# EAGLE schematic Rollo_APP_TS_V0.3 (EAGLE 6.4)
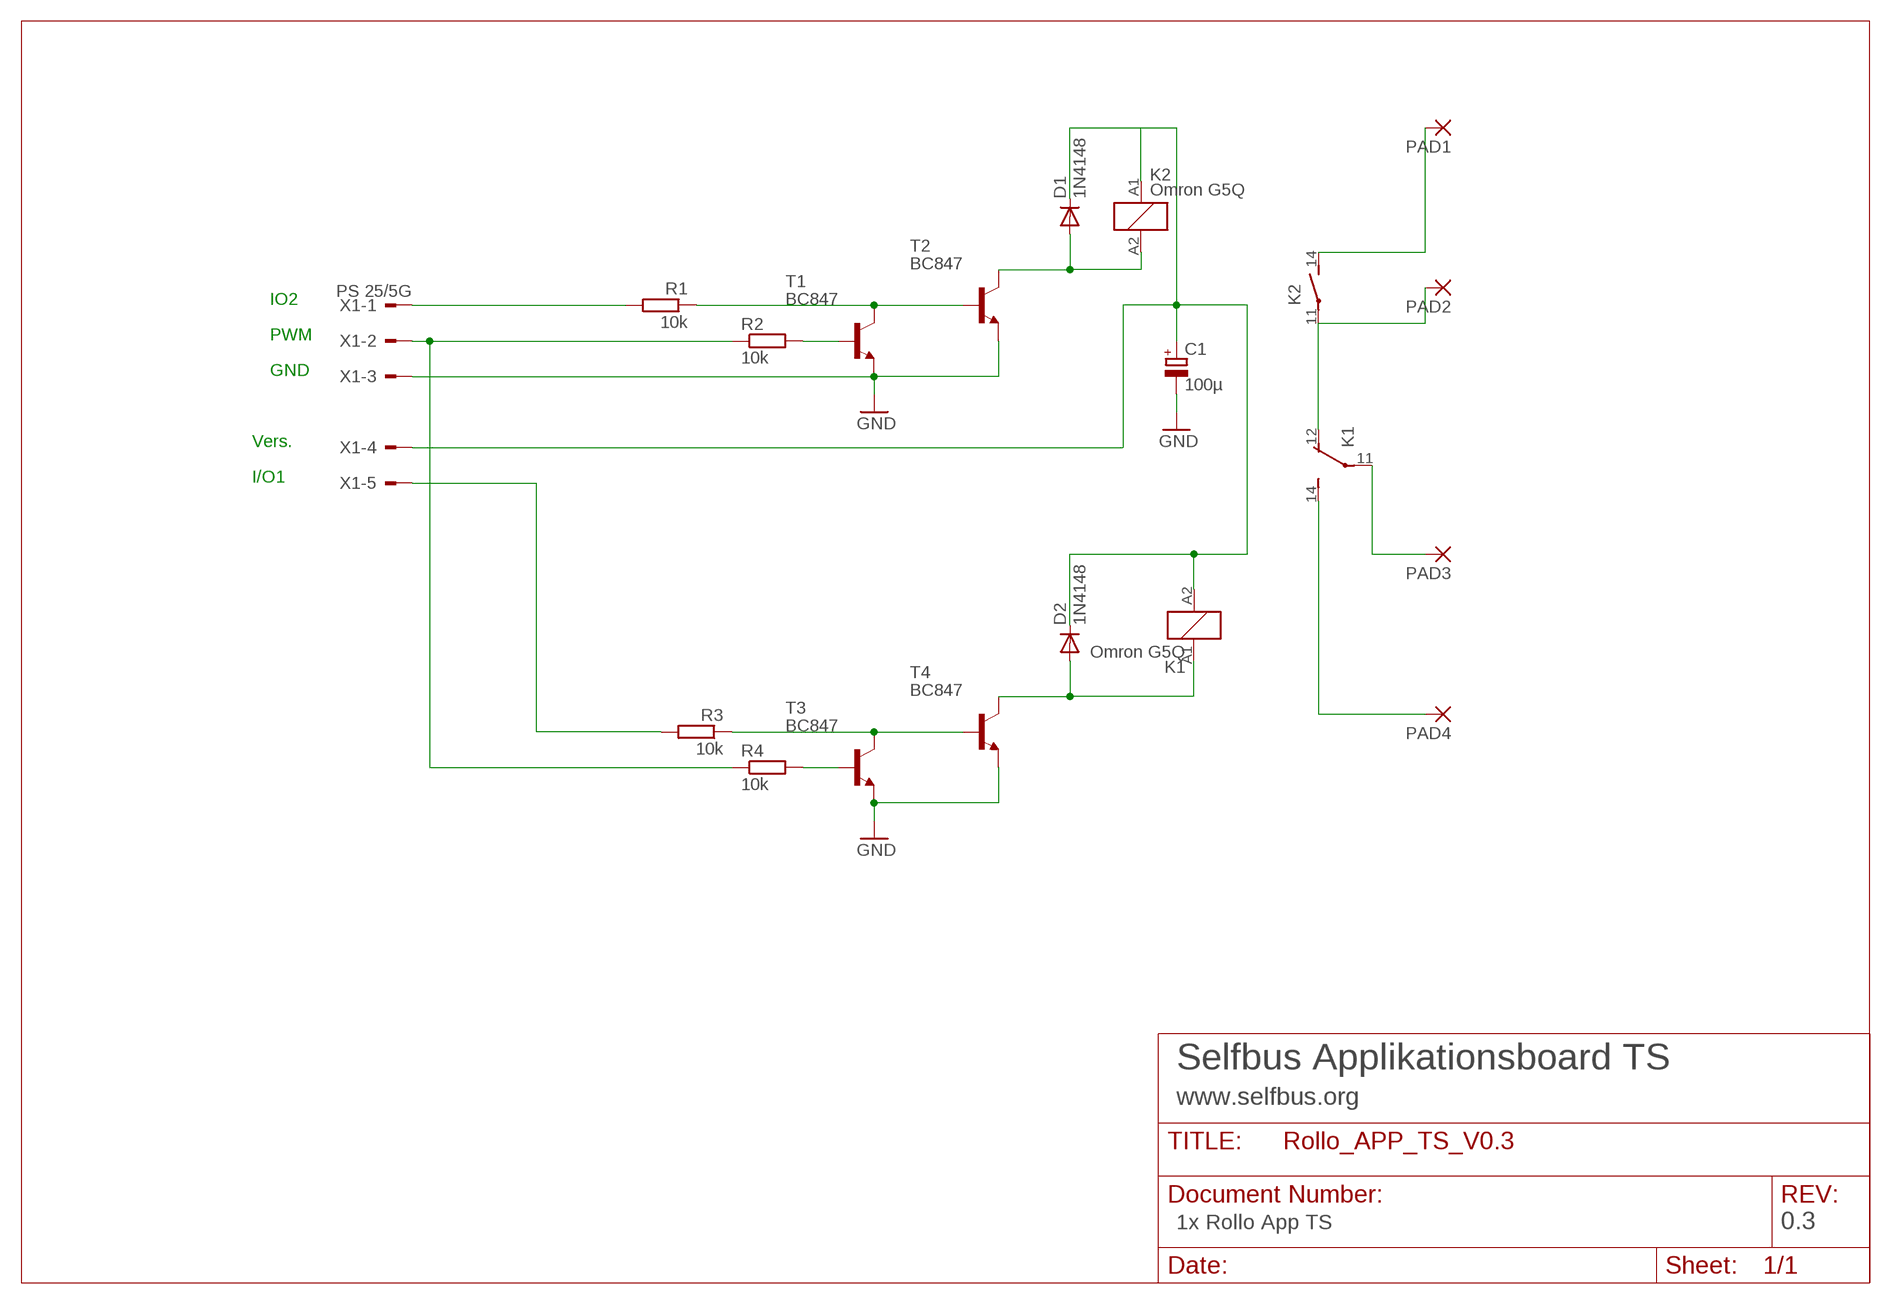
[diagram p0: schematic, sheet 1]

## Parts
C1  100µ  CPOL-EUE3.5-8  [E3,5-8]
D1  1N4148  DIODE-MINIMELF  [MINIMELF]
D2  1N4148  DIODE-MINIMELF  [MINIMELF]
K1  Omron G5Q  FREEBUS_RELAY_RE03U  [FREEBUS_RELAY_G5Q_1_EU]
K2  Omron G5Q  RE030024  [RE-SCHRACK]
PAD1  3,81/1,4  [3,81/1,4]
PAD2  3,81/1,4  [3,81/1,4]
PAD3  3,81/1,4  [3,81/1,4]
PAD4  3,81/1,4  [3,81/1,4]
R1  10k  R-EU_M1206  [M1206]
R2  10k  R-EU_M1206  [M1206]
R3  10k  R-EU_M1206  [M1206]
R4  10k  R-EU_M1206  [M1206]
T1  BC847  [SOT23]
T2  BC847  [SOT23]
T3  BC847  [SOT23]
T4  BC847  [SOT23]
X1  PS 25/5G  741256-49  [741256-49]

## Nets
GND: C1.- T1.2(E) T2.2(E) T3.2(E) T4.2(E) X1.3
N$1: K1.12(14:O) K2.11(2:P) PAD2.1(P)
N$2: R1.2 X1.1
N$3: K2.14(2:S) PAD1.1(P)
N$4: R3.2 X1.5
N$5: K1.14(14:S) PAD4.1(P)
N$6: K1.11(14:P) PAD3.1(P)
N$7: R2.1 R4.1 X1.2
N$8: R3.1 T3.3(C) T4.1(B)
N$9: R4.2 T3.1(B)
N$14: R1.1 T1.3(C) T2.1(B)
N$21: R2.2 T1.1(B)
R1: D2.A K1.A1 T4.3(C)
R3: D1.A K2.A2 T2.3(C)
VDD_IN1: C1.+ D1.C D2.C K1.A2 K2.A1 X1.4

## Notes on the sheet
- IO2
- PWM
- GND
- Vers.
- I/O1
- Selfbus Applikationsboard TS
- www.selfbus.org
- 1x Rollo App TS | 0.3

## Library data of the parts
C1 = rcl:CPOL-EU: POLARIZED CAPACITOR, European symbol
D1 D2 = diode:DIODE-: DIODE
K1 = hardware_application_relais8_4te_fb_relais_8_230V_83c:FREEBUS_RELAY_RE03U
K2 = relay:RE03*: Miniature PCB Relay 1 pole 6 A SCHRACK Source: http://www.schrack.com/.. 5812.pdf; MF: TYCO ELECTRONICS; MPN: RE030024; OC_FARNELL: 515851; OC_NEWARK: 52F910
PAD1-PAD4 = wirepad:3,81/1,4: THROUGH-HOLE PAD
R1-R4 = rcl:R-EU_: RESISTOR, European symbol
T1-T4 = transistor:BC847: NPN TRANSISTOR
X1 = con-conrad:741256-49: Connector with Kabel